# EAGLE schematic playgroundFilter (EAGLE 9.6.2)
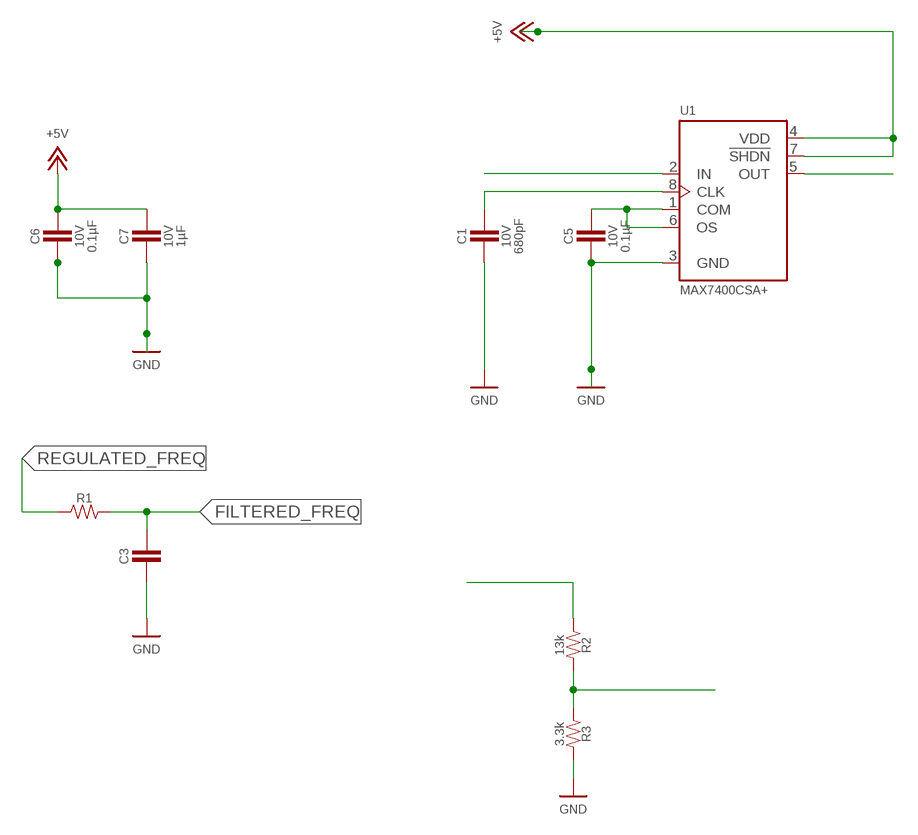
[diagram p0: schematic, sheet 1, part 1 of 2]
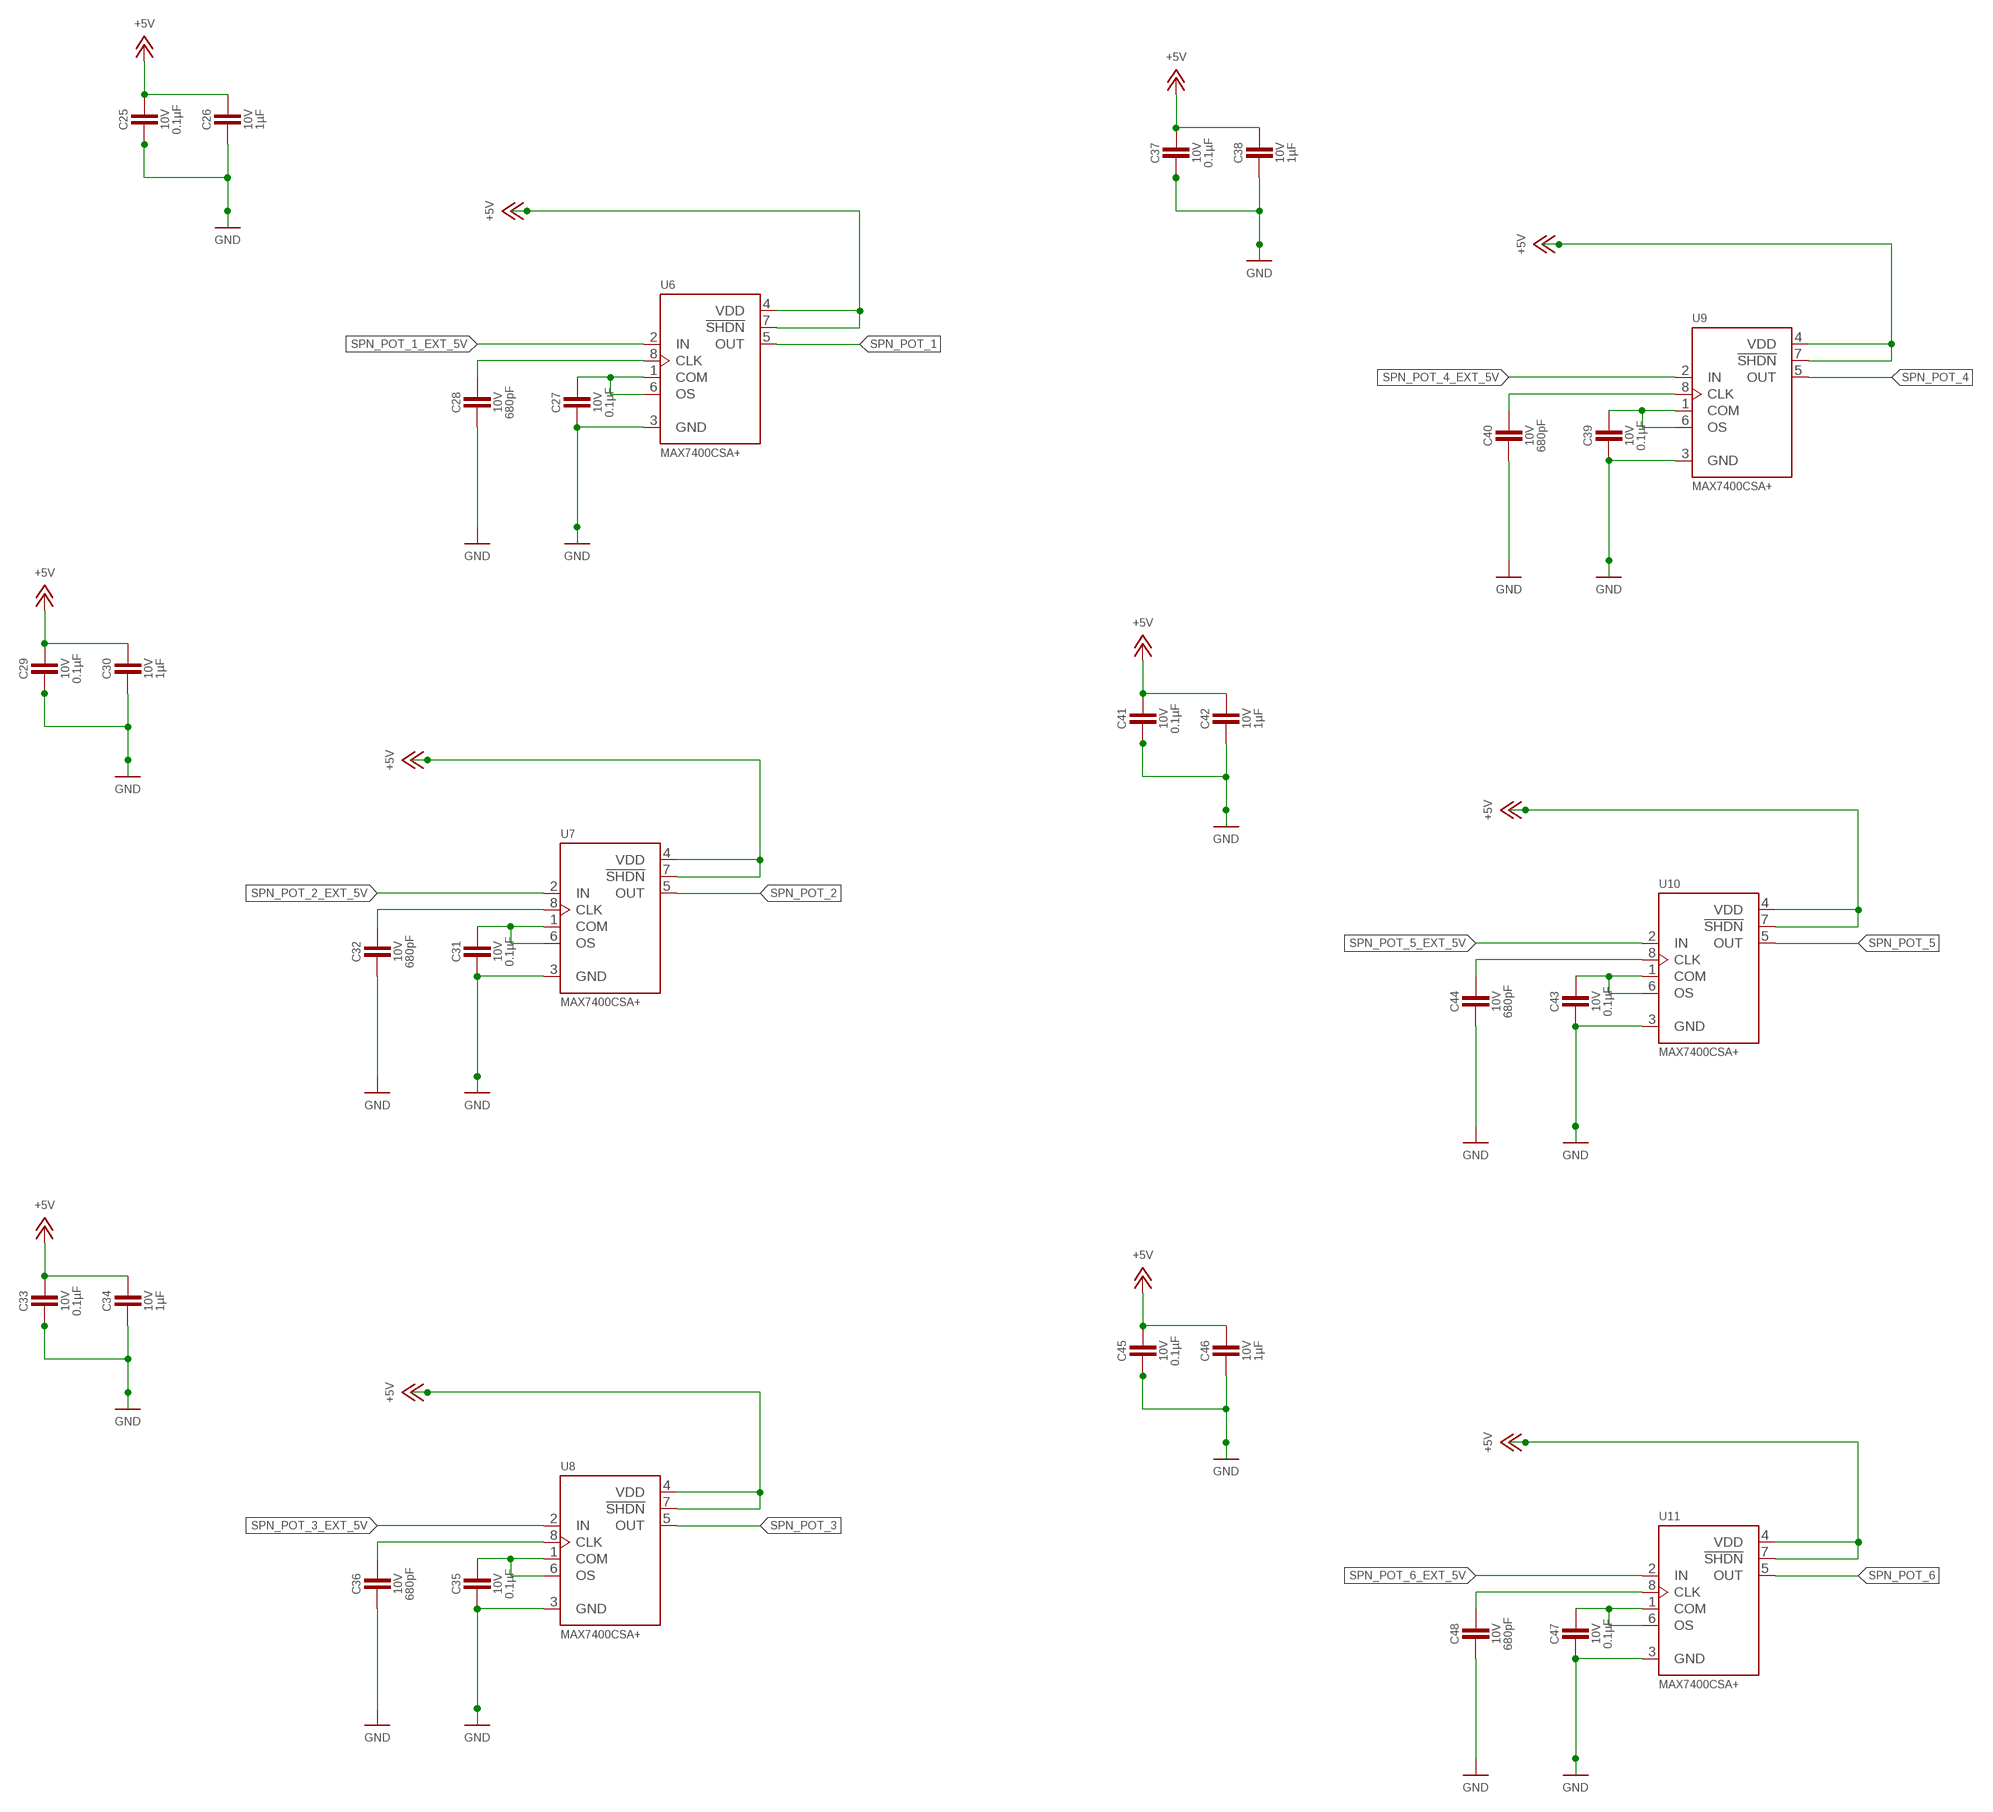
[diagram p1: schematic, sheet 1, part 2 of 2]

## Parts
C1  CAPACITOR_0603_10V_680PF  [0603-CAP]
C3  CAPACITOR  (no package)
C5  CAPACITOR_0603_10V_0.1UF  [0603-CAP]
C6  CAPACITOR_0603_10V_0.1UF  [0603-CAP]
C7  CAPACITOR_0603_10V_1UF  [0603-CAP]
C25  CAPACITOR_0603_10V_0.1UF  [0603-CAP]
C26  CAPACITOR_0603_10V_1UF  [0603-CAP]
C27  CAPACITOR_0603_10V_0.1UF  [0603-CAP]
C28  CAPACITOR_0603_10V_680PF  [0603-CAP]
C29  CAPACITOR_0603_10V_0.1UF  [0603-CAP]
C30  CAPACITOR_0603_10V_1UF  [0603-CAP]
C31  CAPACITOR_0603_10V_0.1UF  [0603-CAP]
C32  CAPACITOR_0603_10V_680PF  [0603-CAP]
C33  CAPACITOR_0603_10V_0.1UF  [0603-CAP]
C34  CAPACITOR_0603_10V_1UF  [0603-CAP]
C35  CAPACITOR_0603_10V_0.1UF  [0603-CAP]
C36  CAPACITOR_0603_10V_680PF  [0603-CAP]
C37  CAPACITOR_0603_10V_0.1UF  [0603-CAP]
C38  CAPACITOR_0603_10V_1UF  [0603-CAP]
C39  CAPACITOR_0603_10V_0.1UF  [0603-CAP]
C40  CAPACITOR_0603_10V_680PF  [0603-CAP]
C41  CAPACITOR_0603_10V_0.1UF  [0603-CAP]
C42  CAPACITOR_0603_10V_1UF  [0603-CAP]
C43  CAPACITOR_0603_10V_0.1UF  [0603-CAP]
C44  CAPACITOR_0603_10V_680PF  [0603-CAP]
C45  CAPACITOR_0603_10V_0.1UF  [0603-CAP]
C46  CAPACITOR_0603_10V_1UF  [0603-CAP]
C47  CAPACITOR_0603_10V_0.1UF  [0603-CAP]
C48  CAPACITOR_0603_10V_680PF  [0603-CAP]
R1  RESISTOR  (no package)
R2  RESISTOR_0603_13K  [0603-RES]
R3  RESISTOR_0603_3.3K  [0603-RES]
U1  MAX7400  [SOIC-08(NARROW,0.15")]
U6  MAX7400  [SOIC-08(NARROW,0.15")]
U7  MAX7400  [SOIC-08(NARROW,0.15")]
U8  MAX7400  [SOIC-08(NARROW,0.15")]
U9  MAX7400  [SOIC-08(NARROW,0.15")]
U10  MAX7400  [SOIC-08(NARROW,0.15")]
U11  MAX7400  [SOIC-08(NARROW,0.15")]

## Nets
+5V: U1.4(VDD) U1.7(!SHDN) U6.4(VDD) U6.7(!SHDN) U7.4(VDD) U7.7(!SHDN) U8.4(VDD) U8.7(!SHDN) U9.4(VDD) U9.7(!SHDN) U10.4(VDD) U10.7(!SHDN) U11.4(VDD) U11.7(!SHDN)
FILTERED_FREQ: C3.1 R1.2
GND: C1.2 C3.2 C5.2 C6.2 C7.2 C25.2 C26.2 C27.2 C28.2 C29.2 C30.2 C31.2 C32.2 C33.2 C34.2 C35.2 C36.2 C37.2 C38.2 C39.2 C40.2 C41.2 C42.2 C43.2 C44.2 C45.2 C46.2 C47.2 C48.2 R3.2 U1.3(GND) U6.3(GND) U7.3(GND) U8.3(GND) U9.3(GND) U10.3(GND) U11.3(GND)
N$1: U1.2(IN)
N$2: U1.5(OUT)
N$3: C1.1 U1.8(CLK)
N$4: C5.1 U1.1(COM) U1.6(OS)
N$5: R2.1
N$13: C28.1 U6.8(CLK)
N$14: C27.1 U6.1(COM) U6.6(OS)
N$15: C32.1 U7.8(CLK)
N$16: C31.1 U7.1(COM) U7.6(OS)
N$17: C36.1 U8.8(CLK)
N$18: C35.1 U8.1(COM) U8.6(OS)
N$19: C40.1 U9.8(CLK)
N$20: C39.1 U9.1(COM) U9.6(OS)
N$21: C44.1 U10.8(CLK)
N$22: C43.1 U10.1(COM) U10.6(OS)
N$23: C48.1 U11.8(CLK)
N$24: C47.1 U11.1(COM) U11.6(OS)
REGULATED_FREQ: C6.1 C7.1 C25.1 C26.1 C29.1 C30.1 C33.1 C34.1 C37.1 C38.1 C41.1 C42.1 C45.1 C46.1 R1.1 ; supply symbol labelled +5V
REGULATED_SIGNAL: R2.2 R3.1
SPN_POT_1: U6.5(OUT)
SPN_POT_1_EXT_5V: U6.2(IN)
SPN_POT_2: U7.5(OUT)
SPN_POT_2_EXT_5V: U7.2(IN)
SPN_POT_3: U8.5(OUT)
SPN_POT_3_EXT_5V: U8.2(IN)
SPN_POT_4: U9.5(OUT)
SPN_POT_4_EXT_5V: U9.2(IN)
SPN_POT_5: U10.5(OUT)
SPN_POT_5_EXT_5V: U10.2(IN)
SPN_POT_6: U11.5(OUT)
SPN_POT_6_EXT_5V: U11.2(IN)

## Library data of the parts
C1 C28 C32 C36 C40 C44 C48 = HyTechDevices:CAPACITOR_?_*: Capacitor, Non-Polarized VJ...1BC Series Datasheet <https://www.mouser.com/datasheet/2/427/vjw1bcbascomseries-1762447.pdf> Samsung Datasheet <https://www.mouser.com/datasheet/2/585/MLCC-1837944.pdf> Walsin Datasheet <https://www.mouser.com/datasheet/2/210/WTC_MLCC_General_Purpose-1534899.pdf> GRM188R61A226ME15D <https://www.mouser.com/datasheet/2/281/1/GRM188R61A226ME15_02A-1985787.pdf> GRM188R61E106MA73D <https://www.mouser.com/datasheet/2/281/1/GRM188R61E106MA73_01A-1985806.pdf> 885012006013 <https://www.mouser.com/datasheet/2/445/885012006013-1726946.pdf> 2220Y6300105KXTWS2 <https://www.mouser.com/datasheet/2/218/SMD_High_and_Std_StackiCap_P62-1825512.pdf> Yageo Class 2, X5R <https://www.mouser.com/datasheet/2/447/UPY_GPHC_X5R_4V_to_50V_26-1827097.pdf> TDK C Series <https://www.mouser.com/ProductDetail/TDK/C3216X5R1V226M160AC?qs=%2Fha2pyFadujbcx9jh7lYl%2F4NeMoXFhdc8AqVWNq4wW6M2y7zl6GzBuhgtI0ngznN> AVX Automotive MLCC <https://www.mouser.com/datasheet/2/40/AutoMLCC-777028.pdf> KEMET X7R Series <https://www.mouser.com/datasheet/2/212/KEM_C1002_X7R_SMD-1102033.pdf> Kyocera AVX <https://www.mouser.com/datasheet/2/40/C0GNP0_Dielectric-951274.pdf> GRM21BR61H <https://www.mouser.com/datasheet/2/281/1/GRM21BR61H106KE43_01A-1986884.pdf>; CAPACITANCE: 680pF; DKPN: 732-7757-1-ND; MANUFACTURER: Würth Elektronik; MOPN: 710-885012006013; MPN: 885012006013; TOLERANCE: 5%; VOLTAGE: 10V
C3 = HyTechSymbols:CAPACITOR
C5 C6 C25 C27 C29 C31 C33 C35 C37 C39 C41 C43 C45 C47 = HyTechDevices:CAPACITOR_?_*: Capacitor, Non-Polarized VJ...1BC Series Datasheet <https://www.mouser.com/datasheet/2/427/vjw1bcbascomseries-1762447.pdf> Samsung Datasheet <https://www.mouser.com/datasheet/2/585/MLCC-1837944.pdf> Walsin Datasheet <https://www.mouser.com/datasheet/2/210/WTC_MLCC_General_Purpose-1534899.pdf> GRM188R61A226ME15D <https://www.mouser.com/datasheet/2/281/1/GRM188R61A226ME15_02A-1985787.pdf> GRM188R61E106MA73D <https://www.mouser.com/datasheet/2/281/1/GRM188R61E106MA73_01A-1985806.pdf> 885012006013 <https://www.mouser.com/datasheet/2/445/885012006013-1726946.pdf> 2220Y6300105KXTWS2 <https://www.mouser.com/datasheet/2/218/SMD_High_and_Std_StackiCap_P62-1825512.pdf> Yageo Class 2, X5R <https://www.mouser.com/datasheet/2/447/UPY_GPHC_X5R_4V_to_50V_26-1827097.pdf> TDK C Series <https://www.mouser.com/ProductDetail/TDK/C3216X5R1V226M160AC?qs=%2Fha2pyFadujbcx9jh7lYl%2F4NeMoXFhdc8AqVWNq4wW6M2y7zl6GzBuhgtI0ngznN> AVX Automotive MLCC <https://www.mouser.com/datasheet/2/40/AutoMLCC-777028.pdf> KEMET X7R Series <https://www.mouser.com/datasheet/2/212/KEM_C1002_X7R_SMD-1102033.pdf> Kyocera AVX <https://www.mouser.com/datasheet/2/40/C0GNP0_Dielectric-951274.pdf> GRM21BR61H <https://www.mouser.com/datasheet/2/281/1/GRM21BR61H106KE43_01A-1986884.pdf>; CAPACITANCE: 0.1µF; DKPN: 720-1688-1-ND; MANUFACTURER: Vishay Vitramon; MOPN: 77-VJ0603Y104JXQPBC; MPN: VJ0603Y104JXQPW1BC; TOLERANCE: 5%; VOLTAGE: 10V
C7 C26 C30 C34 C38 C42 C46 = HyTechDevices:CAPACITOR_?_*: Capacitor, Non-Polarized VJ...1BC Series Datasheet <https://www.mouser.com/datasheet/2/427/vjw1bcbascomseries-1762447.pdf> Samsung Datasheet <https://www.mouser.com/datasheet/2/585/MLCC-1837944.pdf> Walsin Datasheet <https://www.mouser.com/datasheet/2/210/WTC_MLCC_General_Purpose-1534899.pdf> GRM188R61A226ME15D <https://www.mouser.com/datasheet/2/281/1/GRM188R61A226ME15_02A-1985787.pdf> GRM188R61E106MA73D <https://www.mouser.com/datasheet/2/281/1/GRM188R61E106MA73_01A-1985806.pdf> 885012006013 <https://www.mouser.com/datasheet/2/445/885012006013-1726946.pdf> 2220Y6300105KXTWS2 <https://www.mouser.com/datasheet/2/218/SMD_High_and_Std_StackiCap_P62-1825512.pdf> Yageo Class 2, X5R <https://www.mouser.com/datasheet/2/447/UPY_GPHC_X5R_4V_to_50V_26-1827097.pdf> TDK C Series <https://www.mouser.com/ProductDetail/TDK/C3216X5R1V226M160AC?qs=%2Fha2pyFadujbcx9jh7lYl%2F4NeMoXFhdc8AqVWNq4wW6M2y7zl6GzBuhgtI0ngznN> AVX Automotive MLCC <https://www.mouser.com/datasheet/2/40/AutoMLCC-777028.pdf> KEMET X7R Series <https://www.mouser.com/datasheet/2/212/KEM_C1002_X7R_SMD-1102033.pdf> Kyocera AVX <https://www.mouser.com/datasheet/2/40/C0GNP0_Dielectric-951274.pdf> GRM21BR61H <https://www.mouser.com/datasheet/2/281/1/GRM21BR61H106KE43_01A-1986884.pdf>; CAPACITANCE: 1µF; DKPN: 311-1796-1-ND; MANUFACTURER: Yageo; MOPN: 603-CC603KRX7R6BB105; MPN: CC0603KRX7R6BB105; TOLERANCE: 10%; VOLTAGE: 10V
R1 = HyTechSymbols:RESISTOR
R2 = HyTechDevices:RESISTOR_?_*: Resistor PWR163 Series <https://www.mouser.com/datasheet/2/54/pwr163-777985.pdf> AC Series <https://www.mouser.com/datasheet/2/447/Yageo_PYu_AC_51_RoHS_L_7_1714230-1874691.pdf> PU Series <https://www.mouser.com/datasheet/2/447/PYu-PU_51_RoHS_L_6-1504619.pdf> ERA Series <https://www.mouser.com/datasheet/2/315/AOA0000C307-1149632.pdf> PWR263 Series <https://www.mouser.com/datasheet/2/54/pwr263s_35-778069.pdf> KTR Series <https://www.mouser.com/datasheet/2/348/ROHM_S_A0011075115_1-2563276.pdf> RC Series <https://www.mouser.com/datasheet/2/447/Yageo_03_18_2021_PYu_RC_Group_51_RoHS_L_11-2199992.pdf> ERJ PB3, PB6 Series <https://www.mouser.com/datasheet/2/315/AOA0000C328-1530132.pdf> ERJ PA2, P03, PA3, P06, P08, P14 Series <https://www.mouser.com/datasheet/2/315/AOA0000C331-1141874.pdf> B20 Series <https://www.ohmite.com/assets/docs/res_200.pdf?r=false> TE Connectivity/Holsworthy RN73 Series <https://www.mouser.com/datasheet/2/418/4/NG_DS_1773270_M-604713.pdf> Vishay Dale D/CRCW e3 <https://www.mouser.com/datasheet/2/427/dcrcwe3-1762152.pdf> Ohmite B20 <https://www.ohmite.com/assets/docs/res_200.pdf?r=false>; DKPN: P13KBECT-ND; MANUFACTURER: Panasonic Electronic Components; MOPN: 667-ERA-3ARW133V; MPN: ERA-3ARW133V; POWER: 0.1W; RESISTANCE: 13k; TOLERANCE: 0.05%; VOLTAGE_CONTINUOUS: 75V; VOLTAGE_MAX: 150V
R3 = HyTechDevices:RESISTOR_?_*: Resistor PWR163 Series <https://www.mouser.com/datasheet/2/54/pwr163-777985.pdf> AC Series <https://www.mouser.com/datasheet/2/447/Yageo_PYu_AC_51_RoHS_L_7_1714230-1874691.pdf> PU Series <https://www.mouser.com/datasheet/2/447/PYu-PU_51_RoHS_L_6-1504619.pdf> ERA Series <https://www.mouser.com/datasheet/2/315/AOA0000C307-1149632.pdf> PWR263 Series <https://www.mouser.com/datasheet/2/54/pwr263s_35-778069.pdf> KTR Series <https://www.mouser.com/datasheet/2/348/ROHM_S_A0011075115_1-2563276.pdf> RC Series <https://www.mouser.com/datasheet/2/447/Yageo_03_18_2021_PYu_RC_Group_51_RoHS_L_11-2199992.pdf> ERJ PB3, PB6 Series <https://www.mouser.com/datasheet/2/315/AOA0000C328-1530132.pdf> ERJ PA2, P03, PA3, P06, P08, P14 Series <https://www.mouser.com/datasheet/2/315/AOA0000C331-1141874.pdf> B20 Series <https://www.ohmite.com/assets/docs/res_200.pdf?r=false> TE Connectivity/Holsworthy RN73 Series <https://www.mouser.com/datasheet/2/418/4/NG_DS_1773270_M-604713.pdf> Vishay Dale D/CRCW e3 <https://www.mouser.com/datasheet/2/427/dcrcwe3-1762152.pdf> Ohmite B20 <https://www.ohmite.com/assets/docs/res_200.pdf?r=false>; DKPN: P20340TR-ND; MANUFACTURER: Panasonic Electronic Components; MOPN: 667-ERJ-PB3D3301V; MPN: ERJ-PB3D3301V; POWER: 0.2W; RESISTANCE: 3.3k; TOLERANCE: 0.5%; VOLTAGE_CONTINUOUS: 25.69V; VOLTAGE_MAX: 150
U1 U6-U11 = HyTechDevices:MAX74*: 8th-Order Maxim Filter MAX7480 Datasheet <https://www.mouser.com/datasheet/2/256/MAX7480-1515905.pdf> MAX7400 Datsheet <https://www.mouser.com/datasheet/2/256/MAX7404-1514314.pdf> Recommended clock capacitor for the MAX7400/MAX7404: 885012006013 <https://www.mouser.com/datasheet/2/445/885012006013-1726946.pdf>; DKPN: MAX7400CSA+-ND; MANUFACTURER: Maxim Integrated; MOPN: 700-MAX7400CSA; MPN: MAX7400CSA+